# EAGLE design GNUBLIN-DIP-EASY_V100 (EAGLE 6.4)
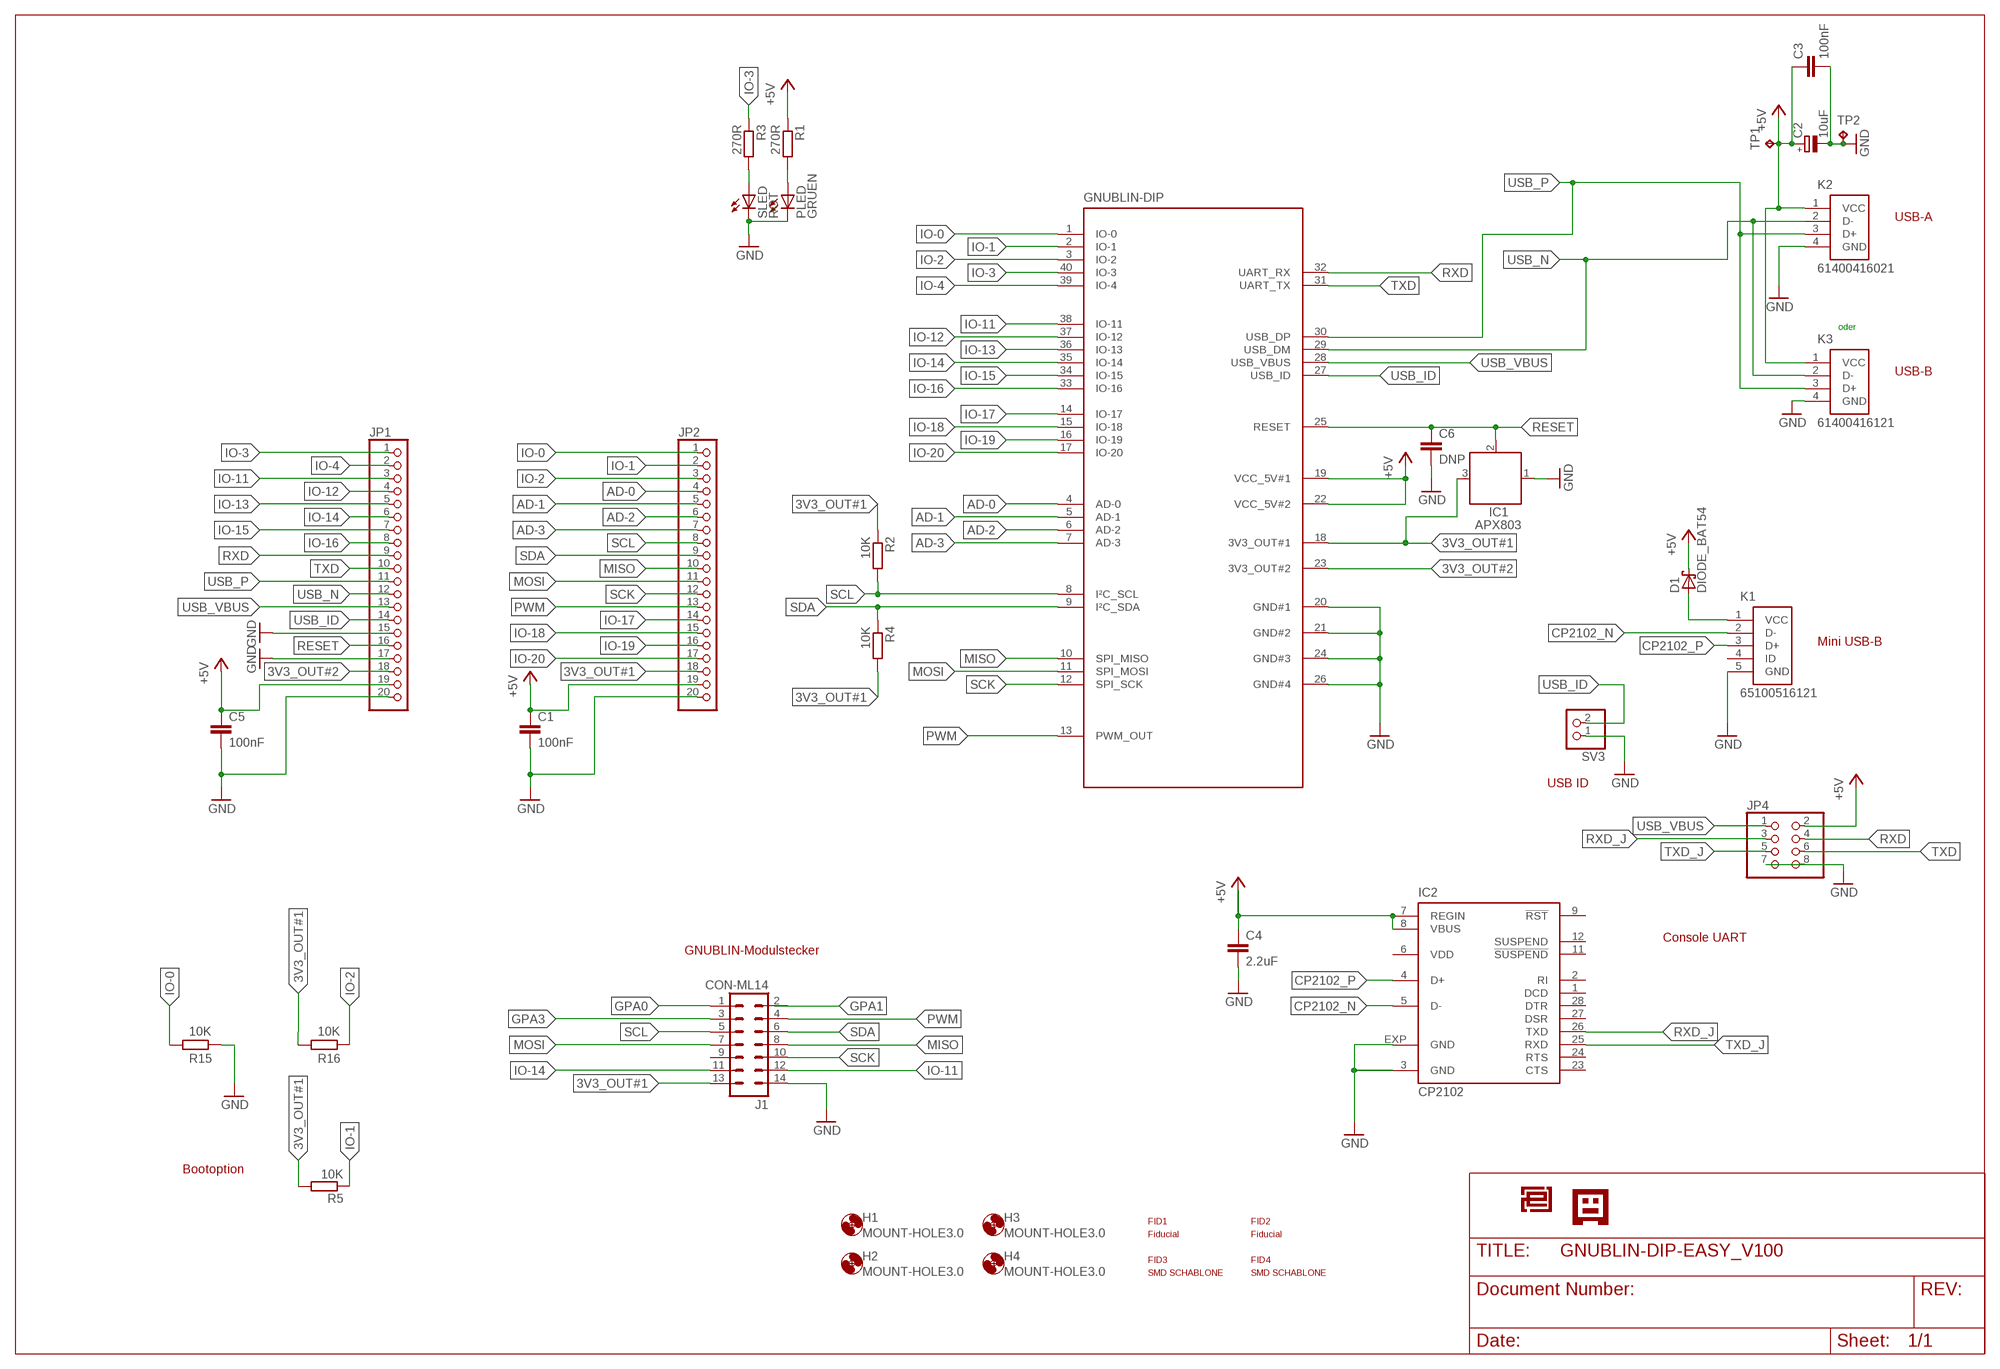
[diagram p0: schematic, sheet 1]

## Parts
C1  100nF  C-EUC0805  [C0805]
C2  10uF  CPOL-EUD/7343-31R  [D/7343-31R]
C3  100nF  C-EUC0805  [C0805]
C4  2.2uF  C-EUC0805  [C0805]
C5  100nF  C-EUC0805  [C0805]
C6  DNP  C-EUC0805  [C0805]
D1  DIODE_BAT54  [SOT-23]
FID1  PASSERMARKEN_FIDUCIAL  [PASSERMARKEN_FIDUCIAL]
FID2  PASSERMARKEN_FIDUCIAL  [PASSERMARKEN_FIDUCIAL]
FID3  PASSERMARKEN_FIDUCIAL  [PASSERMARKEN_FIDUCIAL]
FID4  PASSERMARKEN_FIDUCIAL  [PASSERMARKEN_FIDUCIAL]
H1  MOUNT-HOLE3.0  [3,0]
H2  MOUNT-HOLE3.0  [3,0]
H3  MOUNT-HOLE3.0  [3,0]
H4  MOUNT-HOLE3.0  [3,0]
IC1  APX803  [SOT23]
IC2  CP2102  [MLP28]
J1  CON-ML14  [ML-14]
JP1  PINHD-1X20  [1X20]
JP2  PINHD-1X20  [1X20]
JP4  PINHD-2X4  [2X04]
K1  65100516121  [65100516121]
K2  61400416021  [61400416021]
K3  61400416121  [61400416121]
PLED  GRUEN  LEDCHIPLED_0805  [CHIPLED_0805]
R1  270R  R-EU_R0805  [R0805]
R2  10K  R-EU_R0805  [R0805]
R3  270R  R-EU_R0805  [R0805]
R4  10K  R-EU_R0805  [R0805]
R5  10K  R-EU_R0805  [R0805]
R15  10K  R-EU_R0805  [R0805]
R16  10K  R-EU_R0805  [R0805]
SLED  ROT  LEDCHIPLED_0805  [CHIPLED_0805]
SV3  PINHD-1X2  [1X02]
TP1  TPB1,27  [B1,27]
TP2  TPB1,27  [B1,27]
U4  GNUBLIN-DIP  [DIL40]
U$1  GNUBLIN-LOGODRUCK  [GNUBLINSIEBDRUCK]
U$2  EPLOGOSIEB  [EPLOGOSIEBDRUCK]

## Nets
3V3_OUT#1: IC1.3(VCC) J1.13 JP2.18 R2.1 R4.2 R5.2 R16.1 U4.18(3V3_OUT#1)
3V3_OUT#2: JP1.18 U4.23(3V3_OUT#2)
+5V: C1.1 C2.+ C3.1 C4.1 C5.1 D1.3(C) IC2.7(REGIN) IC2.8(VBUS) JP1.19 JP2.19 JP4.2 K2.1(VCC) K3.1(VCC) R1.1 TP1.TP U4.19(VCC_5V#1) U4.22(VCC_5V#2)
AD-0: JP2.4 U4.4(AD-0)
AD-1: JP2.5 U4.5(AD-1)
AD-2: JP2.6 U4.6(AD-2)
AD-3: JP2.7 U4.7(AD-3)
CP2102_N: IC2.5(D-) K1.2(D-)
CP2102_P: IC2.4(D+) K1.3(D+)
GND: C1.2 C2.- C3.2 C4.2 C5.2 C6.2 IC1.1(GND) IC2.3(GND) IC2.EXP(GND) J1.14 JP1.15 JP1.17 JP1.20 JP2.20 JP4.7 JP4.8 K1.5(GND) K2.4(GND) K3.4(GND) PLED.C R15.2 SLED.C SV3.1 TP2.TP U4.20(GND#1) U4.21(GND#2) U4.24(GND#3) U4.26(GND#4)
GPA0: J1.1
GPA3: J1.3
IO-0: JP2.1 R15.1 U4.1(IO-0)
IO-1: JP2.2 R5.1 U4.2(IO-1)
IO-2: JP2.3 R16.2 U4.3(IO-2)
IO-3: JP1.1 R3.1 U4.40(IO-3)
IO-4: JP1.2 U4.39(IO-4)
IO-11: J1.12 JP1.3 U4.38(IO-11)
IO-12: JP1.4 U4.37(IO-12)
IO-13: JP1.5 U4.36(IO-13)
IO-14: J1.11 JP1.6 U4.35(IO-14)
IO-15: JP1.7 U4.34(IO-15)
IO-16: JP1.8 U4.33(IO-16)
IO-17: JP2.14 U4.14(IO-17)
IO-18: JP2.15 U4.15(IO-18)
IO-19: JP2.16 U4.16(IO-19)
IO-20: JP2.17 U4.17(IO-20)
MISO: J1.8 JP2.10 U4.10(SPI_MISO)
MOSI: J1.7 JP2.11 U4.11(SPI_MOSI)
N$1: R3.2 SLED.A
N$2: D1.1(A) K1.1(VCC)
N$16: PLED.A R1.2
PWM: J1.4 JP2.13 U4.13(PWM_OUT)
RESET: C6.1 IC1.2(!RESET) JP1.16 U4.25(RESET)
RXD: JP1.9 JP4.4 U4.32(UART_RX)
RXD_J: IC2.26(TXD) JP4.3
SCK: J1.10 JP2.12 U4.12(SPI_SCK)
SCL: J1.5 JP2.8 R2.2 U4.8(I²C_SCL)
SDA: J1.6 JP2.9 R4.1 U4.9(I²C_SDA)
TXD: JP1.10 JP4.6 U4.31(UART_TX)
TXD_J: IC2.25(RXD) JP4.5
USB_ID: JP1.14 SV3.2 U4.27(USB_ID)
USB_N: JP1.12 K2.2(D-) K3.2(D-) U4.29(USB_DM)
USB_P: JP1.11 K2.3(D+) K3.3(D+) U4.30(USB_DP)
USB_VBUS: JP1.13 JP4.1 U4.28(USB_VBUS)
Unconnected: IC2.1(DCD) IC2.2(RI) IC2.9(!RST) IC2.11(!SUSPEND) IC2.12(SUSPEND) IC2.23(CTS) IC2.24(RTS) IC2.27(DSR) IC2.28(DTR) J1.2 J1.9 K1.4(ID)

## Notes on the sheet
- USB-A
- oder
- USB-B
- Mini USB-B
- USB ID
- Console UART
- GNUBLIN-Modulstecker
- Bootoption

## Power pins joined to a net without a drawn wire
VDD: IC2.6(VDD)

## Library data of the parts
C1 C3-C6 = rcl:C-EU: CAPACITOR, European symbol
C2 = rcl:CPOL-EU: POLARIZED CAPACITOR, European symbol
D1 = EmbeddedProjectsBauteile:DIODE_BAT54: Schottky Diodes Source: Fairchild .. BAT54.pdf; EP: 400113
FID1 FID2 = KUBUS3:PASSERMARKEN_FIDUCIAL: SMD Passermarke
FID3 FID4 = SMDSCHABLONE:PASSERMARKEN_FIDUCIAL: SMD Passermarke
H1-H4 = holes:MOUNT-HOLE: MOUNTING HOLE with drill center marker
IC1 = APX803:APX803
IC2 = silabs:CP210*: Single-Chip USB to UART Bridge Source: www.silabs.com .. CP2101.pdf / cp2102.pdf; EP: 400135; MF: FARNELL; MPN: CP2102-GM; OC_FARNELL: 9282130; OC_NEWARK: 30K5635
J1 = EmbeddedProjectsBauteile:CON-ML14: HARTING Wannenstecker 2x7 polig
JP1 JP2 = pinhead:PINHD-1X20: PIN HEADER
JP4 = pinhead:PINHD-2X4: PIN HEADER
K1 = Wuerth_Elektronik_eiCan_11_Communication_Connectors_v1_2:65100516121: WR-COM SMT Horizontal 5 Contacts Mini USB Typ B
K2 = Wuerth_Elektronik_eiCan_11_Communication_Connectors_1_2:61400416021: WR-COM Horizontal USB Type A
K3 = Wuerth_Elektronik_eiCan_11_Communication_Connectors_1_2:61400416121: WR-COM Horizontal USB Type B
PLED SLED = led:LED: LED OSRAM: - CHIPLED LG R971, LG N971, LY N971, LG Q971, LY Q971, LO R971, LY R971 LH N974, LH R974 LS Q976, LO Q976, LY Q976 LO Q996 - Hyper CHIPLED LW Q18S LB Q993, LB Q99A, LB R99A - SideLED LS A670, LO A670, LY A670, LG A670, LP A670 LB A673, LV A673, LT A673, LW A673 LH A674 LY A675 LS A676, LA A676, LO A676, LY A676, LW A676 LS A679, LY A679, LG A679 - Hyper Micro SIDELED® LS Y876, LA Y876, LO Y876, LY Y876 LT Y87S - SmartLED LW L88C, LW L88S LB L89C, LB L89S, LG L890 LS L89K, LO L89K, LY L89K LS L896, LA L896, LO L896, LY L896 - TOPLED LS T670, LO T670, LY T670, LG T670, LP T670 LSG T670, LSP T670, LSY T670, LOP T670, LYG T670 LG T671, LOG T671, LSG T671 LB T673, LV T673, LT T673, LW T673 LH T674 LS T676, LA T676, LO T676, LY T676, LB T676, LH T676, LSB T676, LW T676 LB T67C, LV T67C, LT T67C, LS T67K, LO T67K, LY T67K, LW E67C LS E67B, LA E67B, LO E67B, LY E67B, LB E67C, LV E67C, LT E67C LW T67C LS T679, LY T679, LG T679 LS T770, LO T770, LY T770, LG T770, LP T770 LB T773, LV T773, LT T773, LW T773 LH T774 LS E675, LA E675, LY E675, LS T675 LS T776, LA T776, LO T776, LY T776, LB T776 LHGB T686 LT T68C, LB T68C - Hyper Mini TOPLED® LB M676 - Mini TOPLED Santana® LG M470 LS M47K, LO M47K, LY M47K Source: http://www.osram.convergy.de LUXEON: - LUMILED® LXK2-PW12-R00, LXK2-PW12-S00, LXK2-PW14-U00, LXK2-PW14-V00 LXK2-PM12-R00, LXK2-PM12-S00, LXK2-PM14-U00 LXK2-PE12-Q00, LXK2-PE12-R00, LXK2-PE12-S00, LXK2-PE14-T00, LXK2-PE14-U00 LXK2-PB12-K00, LXK2-PB12-L00, LXK2-PB12-M00, LXK2-PB14-N00, LXK2-PB14-P00, LXK2-PB14-Q00 LXK2-PR12-L00, LXK2-PR12-M00, LXK2-PR14-Q00, LXK2-PR14-R00 LXK2-PD12-Q00, LXK2-PD12-R00, LXK2-PD12-S00 LXK2-PH12-R00, LXK2-PH12-S00 LXK2-PL12-P00, LXK2-PL12-Q00, LXK2-PL12-R00 Source: www.luxeon.com KINGBRIGHT: KA-3528ASYC Source: www.kingbright.com
R1-R5 R15 R16 = rcl:R-EU_: RESISTOR, European symbol
SV3 = pinhead:PINHD-1X2: PIN HEADER
TP1 TP2 = testpad:TP: Test pad
U4 = GNUBLIN-DIP:GNUBLIN-DIP: GNUBLIN-DIP (embedded projects GmbH) mit LPC313X und A43E26XX
U$1 = EmbeddedProjectsBauteile:GNUBLIN-LOGO
U$2 = EmbeddedProjectsLogos:EPLOGO

## Net classes
0 default: width 0.2 mm, drill 0.3 mm, clearance 0.2 mm
1 500mA: width 0.356 mm, drill 0.7 mm, clearance 0.254 mm

## Board
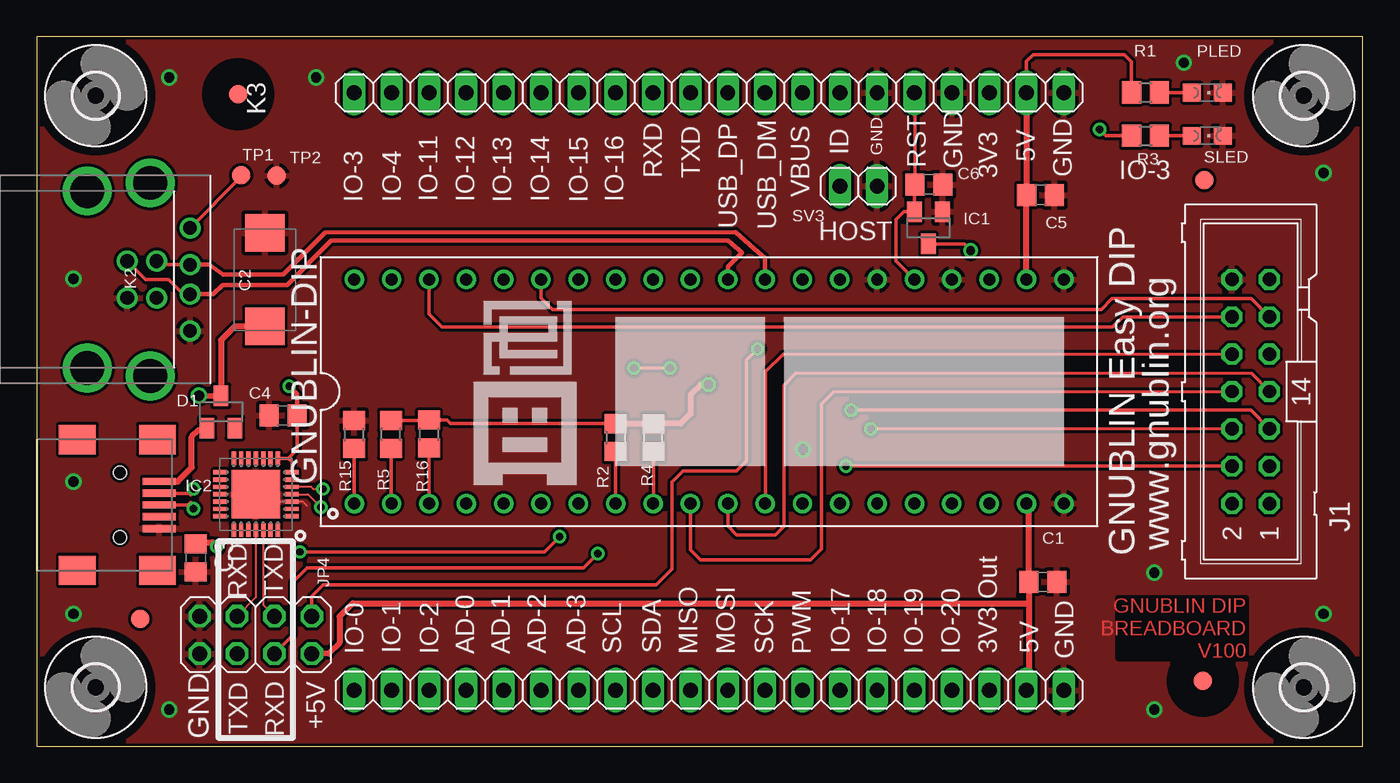
[diagram p1: board, top side]
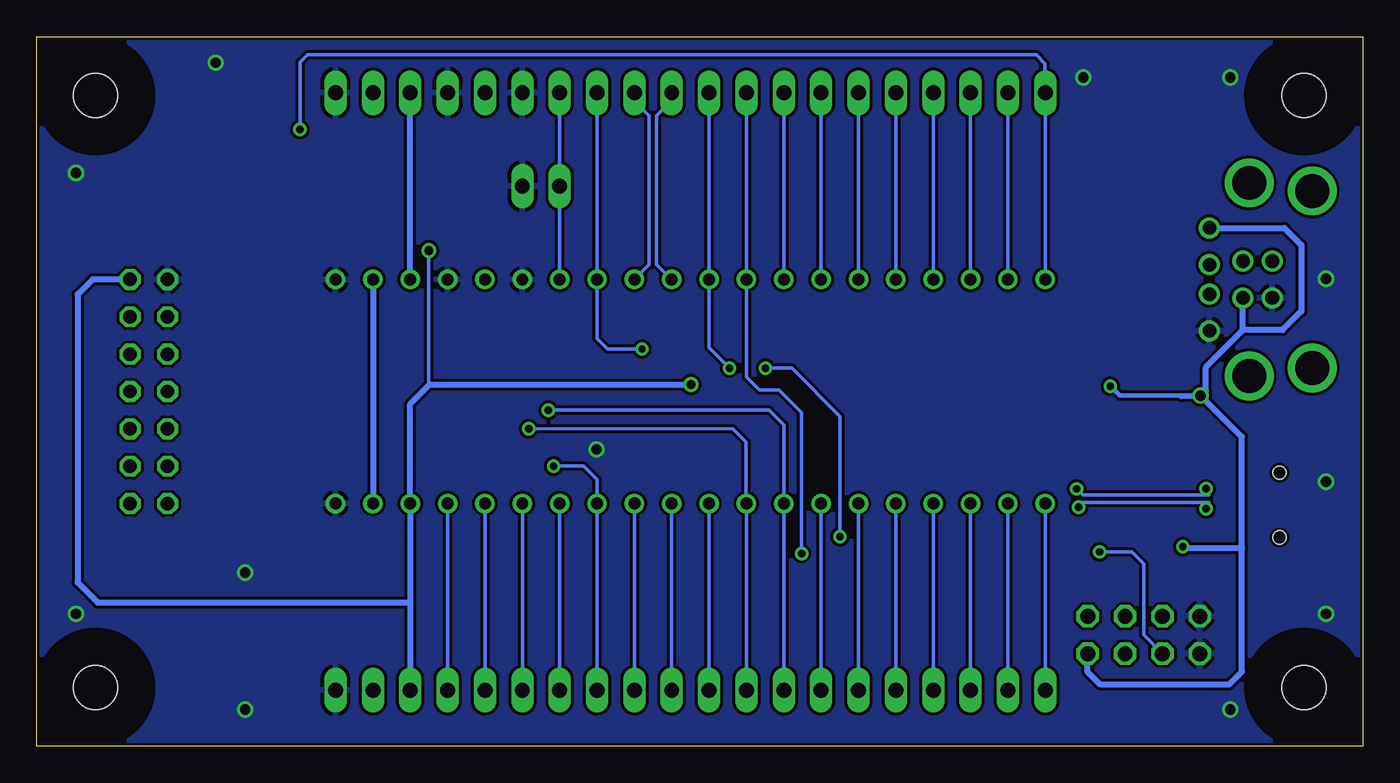
[diagram p2: board, bottom side, seen from below]

Size 90.17 x 48.26 mm. Coordinates in mm from the lower left corner, seen from the top.
Outline: 0,0 90.17,0 90.17,48.26 0,48.26 0,0
Copper layers (1*16): Top 0.035mm / dielectric 1.5mm / Bottom 0.035mm
Design rules "default *": minimum track width 8mil, minimum drill 0.7mm, track to track 4mil, track to pad 4mil, pad to pad 8mil, via to via 6mil, smd to smd 0.2mm, copper to edge 0.2mm, drill to drill 0.2mm, minimum pad ring 10mil, minimum via ring 8mil, stop-mask expansion 2mil, vias tented up to drill 40mil, thermal gap 10mil

### Footprints (pad centres in the part's own frame; a part is rotated, then mirrored left to right if it is on the bottom)
C0805 = smd 1.3 x 1.5: 1 -0.95,0; 2 0.95,0
D/7343-31R = smd 2.55 x 2.7: + 3.175,0; - -3.175,0
SOT-23 = smd 1 x 1.4: 1 -0.95,-1.1; 2 0.95,-1.1; 3 0,1.1
PASSERMARKEN_FIDUCIAL = smd 1.27 x 1.27: 1 0,0
3,0 = hole 3: 0,0
SOT23 = smd 1 x 1.4: 1 -0.95,-1.1; 2 0.95,-1.1; 3 0,1.1
MLP28 = smd 0.9 x 0.3: 1 -2.45,1.5; 2 -2.45,1; 3 -2.45,0.5; 4 -2.45,0; 5 -2.45,-0.5; 6 -2.45,-1; 7 -2.45,-1.5; 15 2.45,-1.5; 16 2.45,-1; 17 2.45,-0.5; 18 2.45,0; 19 2.45,0.5; 20 2.45,1; 21 2.45,1.5 | smd 0.3 x 0.9: 8 -1.5,-2.45; 9 -1,-2.45; 10 -0.5,-2.45; 11 0,-2.45; 12 0.5,-2.45; 13 1,-2.45; 14 1.5,-2.45; 22 1.5,2.45; 23 1,2.45; 24 0.5,2.45; 25 0,2.45; 26 -0.5,2.45; 27 -1,2.45; 28 -1.5,2.45 | smd 3.3 x 3.3: EXP 0,0
ML-14 = drill 0.914 octagon: 1 -7.62,-1.27; 2 -7.62,1.27; 3 -5.08,-1.27; 4 -5.08,1.27; 5 -2.54,-1.27; 6 -2.54,1.27; 7 0,-1.27; 8 0,1.27; 9 2.54,-1.27; 10 2.54,1.27; 11 5.08,-1.27; 12 5.08,1.27; 13 7.62,-1.27; 14 7.62,1.27
1X20 = drill 1.016 long: 1 -24.13,0; 2 -21.59,0; 3 -19.05,0; 4 -16.51,0; 5 -13.97,0; 6 -11.43,0; 7 -8.89,0; 8 -6.35,0; 9 -3.81,0; 10 -1.27,0; 11 1.27,0; 12 3.81,0; 13 6.35,0; 14 8.89,0; 15 11.43,0; 16 13.97,0; 17 16.51,0; 18 19.05,0; 19 21.59,0; 20 24.13,0
2X04 = drill 1.016 octagon: 1 -3.81,-1.27; 2 -3.81,1.27; 3 -1.27,-1.27; 4 -1.27,1.27; 5 1.27,-1.27; 6 1.27,1.27; 7 3.81,-1.27; 8 3.81,1.27
65100516121 = smd 0.5 x 2.25: 1 -1.6,5.685; 2 -0.8,5.685; 3 0,5.685; 4 0.8,5.685; 5 1.6,5.685 | smd 2 x 2.5: Z1 -4.45,5.56; Z2 4.45,5.56; Z3 4.45,0.11; Z4 -4.45,0.11 | hole 0.9: -2.2,3.01; 2.2,3.01
61400416021 = drill 0.92: 1 -3.5,2.7; 2 -1,2.7; 3 1,2.7; 4 3.5,2.7 | drill 2.3: 5 -6.57,0; 6 6.57,0
61400416121 = drill 0.92: 1 1.25,4.71; 2 -1.25,4.71; 3 -1.25,2.71; 4 1.25,2.71 | drill 2.3: Z1 -6.02,0; Z2 6.02,0
CHIPLED_0805 = smd 1.2 x 1.2: A 0,-1.05; C 0,1.05
R0805 = smd 1.3 x 1.5: 1 -0.95,0; 2 0.95,0
1X02 = drill 1.016 long: 1 -1.27,0; 2 1.27,0
B1,27 = smd 1.27 x 1.27: TP 0,0
DIL40 = drill 0.813: 1 3.81,1.27; 2 6.35,1.27; 3 8.89,1.27; 4 11.43,1.27; 5 13.97,1.27; 6 16.51,1.27; 7 19.05,1.27; 8 21.59,1.27; 9 24.13,1.27; 10 26.67,1.27; 11 29.21,1.27; 12 31.75,1.27; 13 34.29,1.27; 14 36.83,1.27; 15 39.37,1.27; 16 41.91,1.27; 17 44.45,1.27; 18 46.99,1.27; 19 49.53,1.27; 20 52.07,1.27; 21 52.07,16.51; 22 49.53,16.51; 23 46.99,16.51; 24 44.45,16.51; 25 41.91,16.51; 26 39.37,16.51; 27 36.83,16.51; 28 34.29,16.51; 29 31.75,16.51; 30 29.21,16.51; 31 26.67,16.51; 32 24.13,16.51; 33 21.59,16.51; 34 19.05,16.51; 35 16.51,16.51; 36 13.97,16.51; 37 11.43,16.51; 38 8.89,16.51; 39 6.35,16.51; 40 3.81,16.51

### Placement (x,y rotation side)
C1  68.41,11.18 0 top
C2  15.52,31.73 270 top
C3  10.82,12.8 270 top
C4  16.75,22.5 180 top
C5  68.26,37.5 0 top
C6  60.67,38.21 0 top
D1  12.53,22.74 0 top
FID1  79.3,4.45 0 top
FID2  13.7,44.34 0 top
FID3  79.39,38.52 0 top
FID4  7.05,8.65 0 top
H1  4,44.26 0 top
H2  86.17,44.26 0 top
H3  86.17,4 0 top
H4  4,4 0 top
IC1  60.64,35.26 180 top
IC2  14.9,17.14 180 top
J1  82.55,24.13 90 top
JP1  45.72,44.45 0 top
JP2  45.72,3.81 0 top
JP4  14.89,7.57 180 top
K1  2.65,16.41 270 top
K2  7.72,31.75 270 top
K3  3.44,31.75 270 top
PLED  79.6,44.46 270 top
R1  75.4,44.47 0 top
R2  39.37,20.99 270 top
R3  75.4,41.52 0 top
R4  41.93,20.99 90 top
R5  24.09,21.21 90 top
R15  21.59,21.2 90 top
R16  26.67,21.23 270 top
SLED  79.6,41.52 270 top
SV3  55.88,38.1 180 top
TP1  13.9,38.84 0 top
TP2  16.32,38.81 0 top
U4  17.78,15.24 0 top
U$1  29.69,17.76 0 top
U$2  30.37,25.29 0 top

### Tracks (layer width: path | path; a pad name or v marks a point on that pad's centre or on a via)
3V3_OUT#1  (via drill 0.6)
  Top 0.254: R2.1 28.13,21.94 27.89,22.18 R16.1 26.65,22.16 R5.2 | IC1.3 63.07,34.16 v63.51,33.72
  Top 0.406: R2.1 R4.2 43.79,21.94 44.47,22.62 44.47,23.92 45.16,24.61 v45.68,24.61
  Bottom 0.254: v63.51,33.72 63.51,24.73 63.46,24.6
  Bottom 0.406: 64.77,9.79 U4.18 64.77,23.29 63.46,24.6 v45.69,24.6 v45.68,24.61 | 64.77,9.79 JP2.18 | J1.13 86.37,31.75 87.39,30.73 87.39,11.13 86.04,9.78 64.78,9.78 64.77,9.79
3V3_OUT#2
  Bottom 0.406: U4.23 JP1.18
+5V  (via drill 0.5, 0.7)
  Top 0.203: C3.1 10.99,13.87
  Top 0.254: IC2.7 17.35,19.32 17.08,19.59 | 17.08,19.59 IC2.8 | C4.1 17.69,20.2 17.08,19.59 | TP1.TP 13.9,38.73 K2.1 | JP1.19 67.31,46.6 67.76,47.05 73.96,47.05 74.45,46.56 R1.1
  Top 0.305: C4.1 17.69,23.96 v17.16,24.49
  Top 0.406: JP1.19 C5.1 U4.22 | 67.45,9.73 C1.1 67.46,16.36 U4.19 | 67.45,9.73 67.46,3.96 JP2.19 | JP4.2 19.86,6.31 20.58,7.03 20.58,8.82 21.48,9.72 67.44,9.72 67.45,9.73 | v11.03,23.85 D1.3 12.53,27.62 13.46,28.55 C2.+ | 10.99,13.87 11.94,13.87 v12.23,13.58
  Bottom 0.305: v17.16,24.49 16.52,23.86 11.06,23.85 v11.03,23.85
  Bottom 0.406: U4.22 U4.19 | 12.32,23.81 v11.03,23.85 | v11.03,23.85 10.66,24.18 10.66,25.79 8.15,28.3 | 8.15,28.3 K3.1 | K2.1 5.33,35.25 4.17,34.09 4.17,29.59 5.46,28.3 8.15,28.3 | JP4.2 18.71,5.05 17.84,4.18 9.11,4.18 8.22,5.07 8.21,13.5 | 11.06,23.85 11.06,23.84 | 8.21,13.5 8.22,21.04 v11.03,23.85 | v12.23,13.58 12.18,13.5 8.21,13.5
AD-0
  Bottom 0.254: U4.4 JP2.4
AD-1
  Bottom 0.254: JP2.5 U4.5
AD-2
  Bottom 0.254: U4.6 JP2.6
AD-3
  Bottom 0.254: JP2.7 U4.7
CP2102_N  (via drill 0.5)
  Top 0.15: v19.46,17.5 18.8,17.5 18.66,17.64 IC2.5
  Top 0.254: K1.2 10.34,17.21 10.47,17.08 v10.65,17.51
  Bottom 0.254: v10.65,17.51 10.47,17.08 18.22,17.08 19.05,17.09 v19.46,17.5
CP2102_P  (via drill 0.5)
  Top 0.15: v19.32,16.26 19,16.58 18.57,17.01 18.44,17.14 IC2.4
  Top 0.254: K1.3 10.3,16.41 10.47,16.58 v10.65,16.15
  Bottom 0.254: v10.65,16.15 10.47,16.58 18.22,16.58 19,16.58 v19.32,16.26
GND  (via drill 0.7)
  Top 0.15: 18.37,16.36 18.09,16.64 IC2.3 16.41,16.64 15.91,17.14 IC2.EXP
  other vias: 9,2.5 2.5,9 2.5,18 9,45.5 76,2.5 87.5,9 76,11.8 87.5,39 78,46.5 19,45.5 2.5,31.8 52.1,20.19
  pour Top: -5,50.44 -5.65,-2.59 93.53,-3.36 93.78,50.8
  pour Bottom: -5.64,50.39 93.53,50.43 93.82,-3.46 68.58,-3.03 -4.32,-2.6
IO-0
  Top 0.254: R15.1 U4.1
  Bottom 0.254: U4.1 JP2.1
IO-1
  Top 0.254: R5.1 24.09,16.55 U4.2
  Bottom 0.254: JP2.2 U4.2
IO-2
  Top 0.254: R16.2 U4.3
  Bottom 0.254: JP2.3 U4.3
IO-3  (via drill 0.5)
  Top 0.254: R3.1 72.7,41.52 v72.27,41.95
  Bottom 0.254: U4.40 JP1.1 21.6,46.43 22.21,47.04 71.76,47.04 72.27,46.53 v72.27,41.95
IO-4
  Bottom 0.254: JP1.2 U4.39
IO-11
  Top 0.254: J1.12 73.84,29.21 73.14,28.51 27.57,28.51 26.67,29.41 U4.38
  Bottom 0.254: U4.38 JP1.3
IO-12
  Bottom 0.254: JP1.4 U4.37
IO-13
  Bottom 0.254: JP1.5 U4.36
IO-14
  Top 0.254: J1.11 82.59,30.44 73.12,30.44 72.4,29.72 35.06,29.72 34.28,30.5 U4.35
  Bottom 0.254: U4.35 JP1.6
IO-15
  Bottom 0.254: JP1.7 U4.34
IO-16
  Bottom 0.254: U4.33 JP1.8
IO-17
  Bottom 0.254: U4.14 JP2.14
IO-18
  Bottom 0.254: JP2.15 U4.15
IO-19
  Bottom 0.254: U4.16 JP2.16
IO-20
  Bottom 0.254: JP2.17 U4.17
MISO
  Top 0.254: J1.8 54.17,24.09 53.35,23.27 53.35,13.42 52.61,12.68 45.13,12.68 44.45,13.36 U4.10
  Bottom 0.254: U4.10 44.45,13.36 JP2.10
MOSI
  Top 0.254: J1.7 82.61,25.34 51.64,25.38 50.81,24.55 50.82,14.95 50.25,14.38 47.59,14.38 46.99,14.98 U4.11
  Bottom 0.254: JP2.11 46.99,14.98 U4.11
N$1
  Top 0.254: SLED.A R3.2
N$2
  Top 0.406: K1.1 9.59,18.01 10.54,18.97 10.54,21.06 11,21.51 D1.1
N$16
  Top 0.254: PLED.A 76.7,44.46 R1.2
PWM  (via drill 0.5)
  Top 0.254: J1.4 v55.03,19.05
  Bottom 0.254: JP2.13 U4.13 52.08,18.15 52.98,19.05 v55.03,19.05
RESET
  Top 0.254: JP1.16 59.72,44.42 C6.1 59.69,38.18 IC1.2 58.98,36.36 58.44,35.82 58.44,33 U4.25
RXD  (via drill 0.5)
  Top 0.254: JP4.4 17.42,7.56 17.41,11.16 18.38,12.13 36.97,12.13 37.18,12.13 v38.16,13.11
  Bottom 0.254: JP1.9 U4.32 41.92,25.11 41.04,24.23 39.69,24.23 38.16,22.7 v38.16,13.11
RXD_J
  Top 0.15: IC2.26 15.4,9.6 JP4.3
SCK
  Top 0.254: J1.10 50.73,26.66 49.55,25.48 U4.12
  Bottom 0.254: U4.12 JP2.12
SCL  (via drill 0.5)
  Top 0.254: R2.2 U4.8 | J1.5 82.55,22.86 v55.38,22.86
  Bottom 0.254: JP2.8 U4.8 39.37,21.85 40.38,22.86 v55.38,22.86
SDA  (via drill 0.5)
  Top 0.254: R4.1 41.93,16.53 U4.9 | J1.6 v56.72,21.6
  Bottom 0.254: JP2.9 U4.9 41.93,16.53 41.93,20.7 42.82,21.59 v56.72,21.6
TXD  (via drill 0.5)
  Top 0.254: v17.89,13.22 34.52,13.22 v35.55,14.25 | v40.62,25.71 v43.05,25.71 v43.06,25.72
  Bottom 0.254: JP1.10 U4.31 44.45,27.13 43.06,25.74 v43.06,25.72 | JP4.6 14.88,7.56 14.88,12.42 15.69,13.23 v17.88,13.23 v17.89,13.22 | v35.55,14.25 35.55,22.44 38.82,25.71 v40.62,25.71
TXD_J
  Top 0.15: IC2.25 14.9,10.12 JP4.5
USB_ID
  Bottom 0.254: U4.27 SV3.2 JP1.14
USB_N
  Top 0.254: K2.2 8.4,32.75 K3.2
  Top 0.3: K2.2 11.73,32.75 12.66,32.07 16.77,32.07 19.62,34.94 47.51,34.96 48.76,33.84 49.53,33.2 U4.29
  Bottom 0.254: JP1.12 49.53,43.91 48.52,42.9 48.52,32.76 U4.29
USB_P
  Top 0.254: K2.3 9.97,30.76 8.98,31.75 7.41,31.75 K3.3
  Top 0.3: U4.30 46.99,32.61 47.95,33.57 47.01,34.4 20.03,34.38 17.04,31.37 12.64,31.37 12.01,30.75 K2.3
  Bottom 0.254: JP1.11 46.99,43.93 48.02,42.9 48.02,32.78 U4.30
USB_VBUS  (via drill 0.5)
  Top 0.254: JP4.1 18.69,10.19 19.46,10.97 42.03,10.97 42.12,10.97 43.21,12.06 43.21,17.97 43.95,18.71 47.58,18.71 48.26,19.39 48.26,26.27 v49.01,27.02
  Bottom 0.254: JP1.13 U4.28 52.07,27.74 51.35,27.02 v49.01,27.02

### Text on the board
Top: GNUBLIN DIP / BREADBOARD / V100
tPlace: ID | GND | 5V | IO-3 | RXD | TXD | RST | GND | 3V3 | GND | IO-3 | IO-4 | IO-11 | IO-12 | IO-13 | IO-14 | IO-15 | IO-16 | VBUS | HOST | USB_DP | USB_DM | RXD | TXD | GNUBLIN Easy DIP | www.gnublin.org | IO-0 | IO-1 | IO-2 | AD-0 | AD-1 | AD-2 | AD-3 | SCL | SDA | MISO | MOSI | SCK | PWM | IO-17 | IO-18 | IO-19 | IO-20 | 3V3 Out | 5V | GND | TXD | RXD | +5V | GND
bDruck: 26 | 25 | VCC | GND | 2 | 9 | 8 | 7 | 6 | 5 | 4 | 3 | 31 | 30 | 29 | 28 | 27 | Status | 32 | 7 | PC | 0 | PB | 0 | Port E | 7 | Power | 7 | 25 | RST | BUTTON1 | LEDs | ISP | 3 | LED 1 | USB | 4 | 5 | 6 | 7 | 8 | 9 | LED 7 | www.embedded-projects.net | Open-Source SW+HW | Octopus Hutschiene v1.1 | AREF | HWB | 7 | 0 | UART | Port A | AGND | TX | RX | GND | PF (AD) | 7 | PD | 0 | 7 | 0 | 10 | 11 | 12 | 13 | 14 | 15 | 17 | 48 | 47 | 46 | 45 | 44 | 43 | 42 | 41 | 16